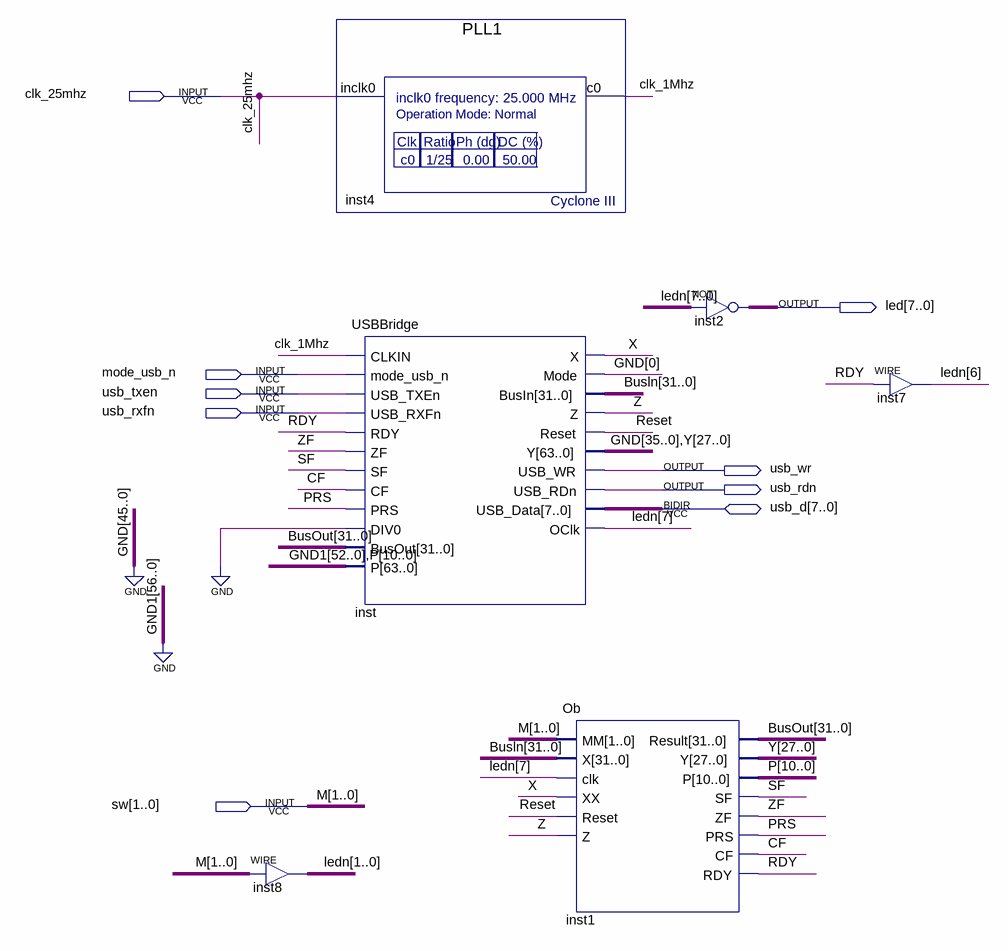
[diagram p0: schematic sheet]
// Quartus schematic ALUUAPR.bdf as structural Verilog: 6 symbols, 9 pins
module ALUUAPR (
  input  clk_25mhz,
  input  mode_usb_n,
  input  usb_txen,
  input  usb_rxfn,
  input  [1:0] sw,
  inout  [7:0] usb_d,
  output [7:0] led,
  output usb_wr,
  output usb_rdn
);

  wire CF, clk_1Mhz, PRS, RDY, Reset, SF, X, Z, ZF;
  wire [7:0] ledn;
  wire [10:0] P;
  wire [27:0] Y;
  wire [31:0] Busln, BusOut;
  wire [35:0] GND;

  assign ledn[1:0] = sw;  // WIRE inst8
  PLL1 inst4 (.inclk0(clk_25mhz), .c0(clk_1Mhz));
  USBBridge inst (
    .CLKIN(clk_1Mhz), .mode_usb_n(mode_usb_n), .USB_TXEn(usb_txen), .USB_RXFn(usb_rxfn), .RDY(RDY), .ZF(ZF),
    .SF(SF), .CF(CF), .PRS(PRS), .DIV0(1'b0), .BusOut(BusOut), .P({{53{1'b0}}, P}), .X(X), .Mode(GND[0]),
    .BusIn(Busln), .Z(Z), .Reset(Reset), .Y({GND, Y}), .USB_WR(usb_wr), .USB_RDn(usb_rdn), .OClk(ledn[7]),
    .USB_Data(usb_d));
  Ob inst1 (
    .MM(sw), .X(Busln), .clk(ledn[7]), .XX(X), .Reset(Reset), .Z(Z), .Result(BusOut), .Y(Y), .P(P), .SF(SF),
    .ZF(ZF), .PRS(PRS), .CF(CF), .RDY(RDY));
  assign led = ~ledn;  // NOT inst2, 8 bits wide
  assign ledn[6] = RDY;  // WIRE inst7
  // also tied to GND on the sheet: {GND[0], GND[1], GND[2], GND[3], GND[4], GND[5], GND[6], GND[7], GND[8], GND[9], GND[10], GND[11], GND[12], GND[13], GND[14], GND[15], GND[16], GND[17], GND[18], GND[19], GND[20], GND[21], GND[22], GND[23], GND[24], GND[25], GND[26], GND[27], GND[28], GND[29], GND[30], GND[31], GND[32], GND[33], GND[34], GND[35]}

  // Other names for the same wires on the sheet: M[1:0] = sw
endmodule
